# EasyEDA Pro project NRMgmtCRB_v2_final.epro, schematic Schematic1, sheet 1 of 3

## Sheets
1 SoC: Assembly Variant: Basic; Board Name: Board1; Create Date: 2026-01-25; Page Name: P1; Project Name: NRMgmtCRB_v2; Schematic Name: Schematic1; Update Date: 2026-01-25; BladeWidth: 10; Company: 嘉立创EDA; Page Size: A4; RegionStart: 1; ShowBorder: 1; TitleBlock: 0; TitleBlockPosition: 3; Version: V1.0; XRegionCount: 6; YRegionCount: 4
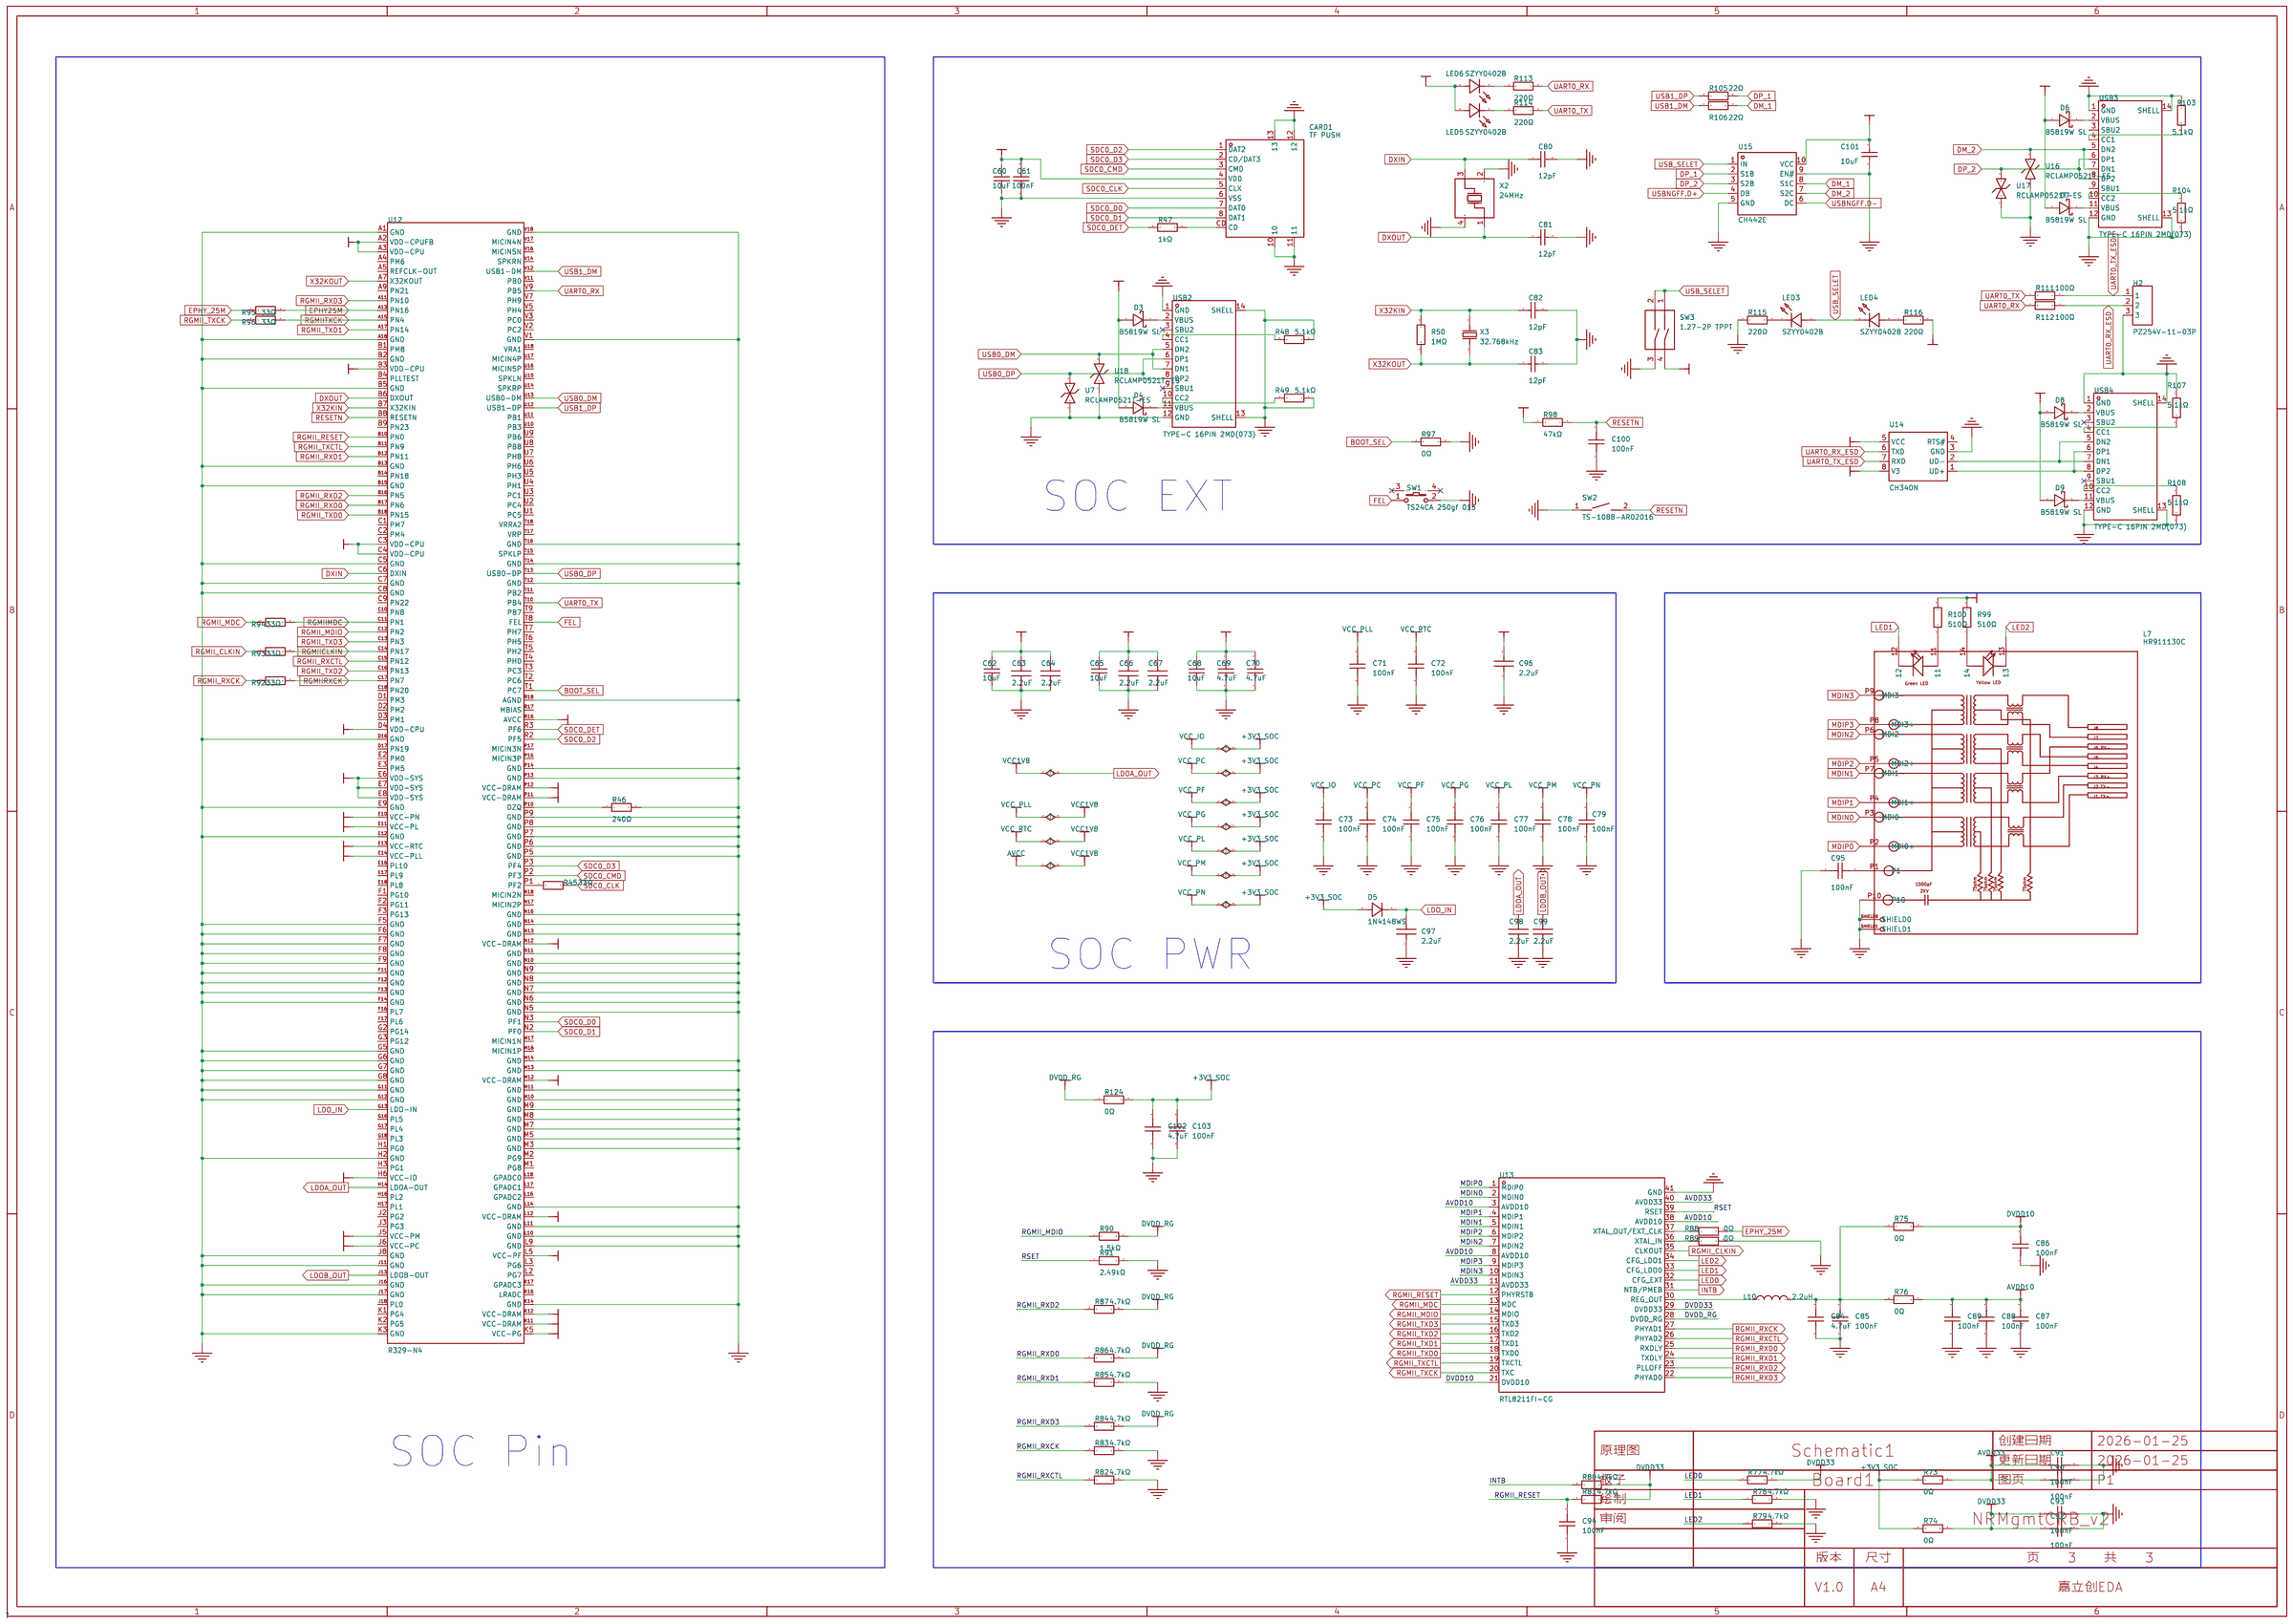
[diagram p0: SoC]

## Parts
C60  10uF  [C0402]
C61  100nF  [C0402]
C62  10uF  [C0402]
C63  2.2uF  [C0402]
C64  2.2uF  [C0402]
C65  10uF  [C0402]
C66  2.2uF  [C0402]
C67  2.2uF  [C0402]
C68  10uF  [C0402]
C69  4.7uF  [C0402]
C70  4.7uF  [C0402]
C71  100nF  [C0402]
C72  100nF  [C0402]
C73  100nF  [C0402]
C74  100nF  [C0402]
C75  100nF  [C0402]
C76  100nF  [C0402]
C77  100nF  [C0402]
C78  100nF  [C0402]
C79  100nF  [C0402]
C80  12pF  [C0402]
C81  12pF  [C0402]
C82  12pF  [C0402]
C83  12pF  [C0402]
C84  4.7uF  [C0402]
C85  100nF  [C0402]
C86  100nF  [C0402]
C87  100nF  [C0402]
C88  100nF  [C0402]
C89  100nF  [C0402]
C90  100nF  [C0402]
C91  100nF  [C0402]
C92  100nF  [C0402]
C93  100nF  [C0402]
C94  100nF  [C0402]
C95  100nF  [C0603]
C96  2.2uF  [C0402]
C97  2.2uF  [C0402]
C98  2.2uF  [C0402]
C99  2.2uF  [C0402]
C100  100nF  [C0402]
C101  10uF  [C0402]
C102  4.7uF  [C0402]
C103  100nF  [C0402]
CARD1  TF PUSH  [TF-SMD_TF-PUSH]
D3  B5819W SL  [SOD-123_L2.7-W1.6-LS3.7-RD-1]
D4  B5819W SL  [SOD-123_L2.7-W1.6-LS3.7-RD-1]
D5  1N4148WS  [SOD-323_L1.7-W1.3-LS2.5-FD]
D6  B5819W SL  [SOD-123_L2.7-W1.6-LS3.7-RD-1]
D7  B5819W SL  [SOD-123_L2.7-W1.6-LS3.7-RD-1]
D8  B5819W SL  [SOD-123_L2.7-W1.6-LS3.7-RD-1]
D9  B5819W SL  [SOD-123_L2.7-W1.6-LS3.7-RD-1]
H2  PZ254V-11-03P  [HDR-TH_3P-P2.54-V-M_PZ254V-11-03P]
L7  HR911130C  [RJ45-TH_HR911130C]
L10  2.2uH  [IND-SMD_L2.0-W1.6-B]
LED3  SZYY0402B  [LED0402-RD_BLUE]
LED4  SZYY0402B  [LED0402-RD_BLUE]
LED5  SZYY0402B  [LED0402-RD_BLUE]
LED6  SZYY0402B  [LED0402-RD_BLUE]
R45  33Ω  [R0402]
R46  240Ω  [R0402]
R47  1kΩ  [R0402]
R48  5.1kΩ  [R0402]
R49  5.1kΩ  [R0402]
R50  1MΩ  [R0402]
R73  0Ω  [R0402]
R74  0Ω  [R0402]
R75  0Ω  [R0402]
R76  0Ω  [R0402]
R77  4.7kΩ  [R0402]
R78  4.7kΩ  [R0402]
R79  4.7kΩ  [R0402]
R80  4.7kΩ  [R0402]
R81  4.7kΩ  [R0402]
R82  4.7kΩ  [R0402]
R83  4.7kΩ  [R0402]
R84  4.7kΩ  [R0402]
R85  4.7kΩ  [R0402]
R86  4.7kΩ  [R0402]
R87  4.7kΩ  [R0402]
R88  0Ω  [R0402]
R89  0Ω  [R0402]
R90  1.5kΩ  [R0402]
R91  2.49kΩ  [R0402]
R92  33Ω  [R0402]
R93  33Ω  [R0402]
R94  33Ω  [R0402]
R95  33Ω  [R0402]
R96  33Ω  [R0402]
R97  0Ω  [R0402]
R98  47kΩ  [R0402]
R99  510Ω  [R0603]
R100  510Ω  [R0603]
R103  5.1kΩ  [R0402]
R104  5.1kΩ  [R0402]
R105  22Ω  [R0402]
R106  22Ω  [R0402]
R107  5.1kΩ  [R0402]
R108  5.1kΩ  [R0402]
R111  100Ω  [R0402]
R112  100Ω  [R0402]
R113  220Ω  [R0402]
R114  220Ω  [R0402]
R115  220Ω  [R0402]
R116  220Ω  [R0402]
R124  0Ω  [R0402]
SW1  TS24CA 250gf 013  [SW-SMD_L4.7-W3.5-P3.35-EH]
SW2  TS-1088-AR02016  [SW-SMD_L3.9-W3.0-P4.45]
SW3  1.27-2P TPPT  [SW-SMD_2P-L5.4-W4.1-P1.27-LS8.4]
U7  RCLAMP0521T-ES  [DFN1006-2L-BI]
U12  R329-N4  [BGA-228_L14.5-W12.0-P0.65-TL_R329-N4]
U13  RTL8211FI-CG  [QFN-40_L5.0-W5.0-P0.40-BL-EP3.7]
U14  CH340N  [SOP-8_L4.9-W3.9-P1.27-LS6.0-BL]
U15  CH442E  [MSOP-10_L3.0-W3.0-P0.50-LS5.0-BL]
U16  RCLAMP0521T-ES  [DFN1006-2L-BI]
U17  RCLAMP0521T-ES  [DFN1006-2L-BI]
U18  RCLAMP0521T-ES  [DFN1006-2L-BI]
USB2  TYPE-C 16PIN 2MD(073)  [USB-C-SMD_TYPE-C-6PIN-2MD-073]
USB3  TYPE-C 16PIN 2MD(073)  [USB-C-SMD_TYPE-C-6PIN-2MD-073]
USB4  TYPE-C 16PIN 2MD(073)  [USB-C-SMD_TYPE-C-6PIN-2MD-073]
X2  24MHz  [CRYSTAL-SMD_4P-L3.2-W2.5-BL]
X3  32.768kHz  [FC-135R_L3.2-W1.5]

## Library data of the parts
C60 C62 C65 C68 C101 = CL05A106MQ5NUNC: 容值:10uF;精度:±20%;额定电压:6.3V;温度系数:X5R;; LCSC Part Name: 10uF ±20% 6.3V; Supplier Part: C15525; Manufacturer: SAMSUNG(三星); Supplier Footprint: 0402; JLCPCB Part Class: Basic Part; Datasheet: https://item.szlcsc.com/datasheet/CL05A106MQ5NUNC/16204.html; Supplier: LCSC; Tolerance: ±20%; Voltage Rating: 6.3V; Temperature Coefficient: X5R
C61 C71 C72 C100 = CL05B104KO5NNNC: 容值:100nF;精度:±10%;额定电压:16V;温度系数:X7R;; LCSC Part Name: 100nF ±10% 16V; Supplier Part: C1525; Manufacturer: SAMSUNG(三星); Supplier Footprint: 0402; JLCPCB Part Class: Basic Part; Datasheet: https://item.szlcsc.com/datasheet/CL05B104KO5NNNC/1877.html; Supplier: LCSC; Tolerance: ±10%; Voltage Rating: 16V; Temperature Coefficient: X7R
C63 C64 C66 C67 C96-C99 = CL05A225MQ5NSNC: 容值:2.2uF;精度:±20%;额定电压:6.3V;温度系数:X5R;; LCSC Part Name: 2.2uF ±20% 6.3V; Supplier Part: C12530; Manufacturer: SAMSUNG(三星); Supplier Footprint: 0402; JLCPCB Part Class: Basic Part; Datasheet: https://item.szlcsc.com/datasheet/CL05A225MQ5NSNC/13164.html; Supplier: LCSC; Tolerance: ±20%; Voltage Rating: 6.3V; Temperature Coefficient: X5R
C69 C70 = CL05A475MP5NRNC: 容值:4.7uF;精度:±20%;额定电压:10V;温度系数:X5R;; LCSC Part Name: 4.7uF ±20% 10V; Supplier Part: C23733; Manufacturer: SAMSUNG(三星); Supplier Footprint: 0402; JLCPCB Part Class: Basic Part; Datasheet: https://item.szlcsc.com/datasheet/CL05A475MP5NRNC/24469.html; Supplier: LCSC; Tolerance: ±20%; Voltage Rating: 10V; Temperature Coefficient: X5R
C73-C79 C85-C94 C103 = CL05B104KO5NNNC: 容值:100nF;精度:±10%;额定电压:16V;温度系数:X7R;; LCSC Part Name: 100nF ±10% 16V; Supplier Part: C1525; Manufacturer: SAMSUNG(三星); Supplier Footprint: 0402; JLCPCB Part Class: Basic Part; Datasheet: https://item.szlcsc.com/datasheet/CL05B104KO5NNNC/1877.html; Supplier: LCSC; Tolerance: ±10%; Voltage Rating: 16V; Temperature Coefficient: X7R; Check: true; Voltage Rated: 16V
C80-C83 = 0402CG120J500NT: 容值:12pF;精度:±5%;额定电压:50V;温度系数:C0G;; LCSC Part Name: 12pF ±5% 50V; Supplier Part: C1547; Manufacturer: FH(风华); Supplier Footprint: 0402; JLCPCB Part Class: Basic Part; Datasheet: https://item.szlcsc.com/datasheet/0402CG120J500NT/1899.html; Supplier: LCSC; Tolerance: ±5%; Voltage Rating: 50V; Temperature Coefficient: C0G
C84 C102 = CL05A475MP5NRNC: 容值:4.7uF;精度:±20%;额定电压:10V;温度系数:X5R;; LCSC Part Name: 4.7uF ±20% 10V; Supplier Part: C23733; Manufacturer: SAMSUNG(三星); Supplier Footprint: 0402; JLCPCB Part Class: Basic Part; Datasheet: https://item.szlcsc.com/datasheet/CL05A475MP5NRNC/24469.html; Supplier: LCSC; Tolerance: ±20%; Voltage Rating: 10V; Temperature Coefficient: X5R; Check: true; Voltage Rated: 10V
C95 = CC0603KRX7R9BB104_1: 容值:100nF;精度:±10%;额定电压:50V;温度系数:X7R;; LCSC Part Name: 100nF ±10% 50V; Supplier Part: C14663; Manufacturer: YAGEO(国巨); Manufacturer Part: CC0603KRX7R9BB104; Supplier Footprint: 0603; JLCPCB Part Class: 基础库; Datasheet: https://item.szlcsc.com/datasheet/CC0603KRX7R9BB104/15331.html; Supplier: LCSC; Tolerance: ±10%; Voltage Rating: 50V; Temperature Coefficient: X7R
CARD1 = TF PUSH: 卡连接方式:自弹式;卡类型:MicroSD卡(TF卡);连接器类型:卡座;本体最大高度:2mm;工作温度:-25℃~+90℃;; LCSC Part Name: 9P，自弹式TF卡座; Supplier Part: C393941; Manufacturer: SHOU HAN(首韩); Supplier Footprint: SMD; JLCPCB Part Class: Extended Part; Datasheet: https://item.szlcsc.com/datasheet/TF%2520PUSH/372553.html; Supplier: LCSC; Card Connection Mode: 自弹式; Card Type: MicroSD卡(TF卡); Connector Type: 卡座; Additional Card Detection Pins: 无; Height Above Board: 2mm; Operating Temperature: -25℃~+90℃
D3 D4 D6-D9 = B5819W SL: 正向压降(Vf):600mV@1A;直流反向耐压(Vr):40V;整流电流:1A;; LCSC Part Name: 电压:40V 电流:1A; Supplier Part: C8598; Manufacturer: CJ(江苏长电/长晶); Supplier Footprint: SOD-123; JLCPCB Part Class: Basic Part; Datasheet: https://item.szlcsc.com/datasheet/B5819W%2520SL/9093.html; Supplier: LCSC; Voltage - Forward(Vf@If): 600mV@1A; Voltage - DC Reverse(Vr): 40V; Current - Rectified: 1A; Non-Repetitive Peak Forward Surge Current: 9A
D5 = 1N4148WS_C7420319: 二极管配置:独立式;正向压降(Vf):1.25V@150mA;直流反向耐压(Vr):100V;整流电流:150mA;反向恢复时间(Trr):4ns;; Supplier Part: C7420319; Manufacturer: R+O(宏嘉诚); Supplier Footprint: SOD-323; JLCPCB Part Class: Extended Part; Datasheet: https://item.szlcsc.com/datasheet/1N4148WS/8397141.html; Supplier: LCSC; Diode Configuration: 独立式; Voltage - Forward(Vf@If): 1.25V@150mA; Voltage - DC Reverse(Vr): 100V; Current - Rectified: 150mA; Pd - Power Dissipation: 200mW; Reverse Leakage Current (Ir): 1uA@75V; Reverse Recovery Time (trr): 4ns; Operating Junction Temperature Range: -55℃~+150℃; Non-Repetitive Peak Forward Surge Current: 2A
H2 = PZ254V-11-03P: 插针结构:1x3P;间距:2.54mm;行距:-;圆针/方针:方针;安装方式:直插;排数:单排;总PIN位数:3P;额定电流:3A;额定电压:250V;配合针长度:6mm;塑高:2.5mm;端接针长度:3mm;工作温度:-40℃~+105℃;颜色:黑色;; LCSC Part Name: 1x3P 间距:2.54mm 方针 直插; Supplier Part: C2937625; Manufacturer: XFCN(兴飞); Supplier Footprint: 插件,P=2.54mm; JLCPCB Part Class: Extended Part; Datasheet: https://item.szlcsc.com/datasheet/PZ254V-11-03P/3293280.html; Supplier: LCSC; Pin Structure: 1x3P; Pitch: 2.54mm; Circluar Pins/Square Pins: 方针; Mounting Type: 直插; Number of Rows: 单排; Number of Pins: 3P; Current Rating: 3A; Voltage Rating (Max): 250V; Length of Mating Pin: 6mm; Insulation Height: 2.5mm; Length of End Connection Pin: 3mm; Operating Temperature: -40℃~+105℃; Color: 黑色
L7 = HR911130C: 连接器类型:RJ45插座;安装方式:弯插;端口数量:1;LED:带LED;屏蔽:有屏蔽;等级:-;触头材质:磷青铜;触头镀层:金;工作温度:0℃~+70℃;; LCSC Part Name: 弯插 带LED; Supplier Part: C50933; Manufacturer: HANRUN(汉仁); Supplier Footprint: 弯插; JLCPCB Part Class: Extended Part; Datasheet: https://item.szlcsc.com/datasheet/HR911130C/51945.html; Supplier: LCSC; Connector Type: RJ45插座; Mounting Type: 弯插; Number of Ports: 1; LED: 带LED; Shielding: 有屏蔽; PoE: 不带PoE; Contact Material: 磷青铜; Contact Plating: 金; Operating Temperature: 0℃~+70℃
L10 = FTC201610S2R2MBCA: 电感值:2.2uH;精度:±20%;额定电流:2.5A;饱和电流(Isat):3A;类型:一体成型电感;; LCSC Part Name: 2.2uH ±20% 3A; Supplier Part: C5832344; Manufacturer: cjiang(长江微电); Supplier Footprint: SMD,1.6x2mm; JLCPCB Part Class: 扩展库; Datasheet: https://atta.szlcsc.com/upload/public/pdf/source/20230602/8FFEDA9C0247A92A0D4B67554BFE4091.pdf; Supplier: LCSC; Tolerance: ±20%; Rated Current: 2.5A; Saturation Current (Isat): 3A; DC Resistance (DCR): 120mΩ; Type: 一体成型电感
LED3-LED6 = SZYY0402B: 发光颜色:蓝色;功率:-;正向电流:5mA;主波长:466nm~469nm;色温:-;发光角度:120°;载带方式:-;工作温度:-40℃~+85℃;; LCSC Part Name: 蓝灯; Supplier Part: C434447; Manufacturer: yongyu(永裕光电); Supplier Footprint: 0402; JLCPCB Part Class: Extended Part; Datasheet: https://atta.szlcsc.com/upload/public/pdf/source/20210222/C434447_30232BB6183B52026028ECA50B9DAB35.pdf; Supplier: LCSC; Emitted Color: 蓝色; Forward Current: 5mA; Dominant Wavelength: 466nm~469nm; Viewing Angle: 120°; Operating Temperature: -40℃~+85℃
R45 R92-R96 = 0402WGF330JTCE: 电阻类型:厚膜电阻;阻值:33Ω;精度:±1%;功率:62.5mW;工作电压:50V;温度系数:±100ppm/℃;; LCSC Part Name: 33Ω ±1% 62.5mW 厚膜电阻; Supplier Part: C25105; Manufacturer: UNI-ROYAL(厚声); Supplier Footprint: 0402; JLCPCB Part Class: Basic Part; Datasheet: https://item.szlcsc.com/datasheet/0402WGF330JTCE/25848.html; Supplier: LCSC; Type: 厚膜电阻; Tolerance: ±1%; Power(Watts): 62.5mW; Voltage-Supply(Max): 50V; Temperature Coefficient: ±100ppm/℃; Operating Temperature: -55℃~+155℃
R46 = 0402WGF2400TCE: 电阻类型:厚膜电阻;阻值:240Ω;精度:±1%;功率:62.5mW;最大工作电压:50V;温度系数:±100ppm/℃;; LCSC Part Name: 240Ω ±1% 62.5mW 厚膜电阻; Supplier Part: C25094; Manufacturer: UNI-ROYAL(厚声); Supplier Footprint: 0402; JLCPCB Part Class: Extended Part; Datasheet: https://atta.szlcsc.com/upload/public/pdf/source/20200306/C422600_1E6D84923E4A46A82E41ADD87F860B5C.pdf; Supplier: LCSC; Type: 厚膜电阻; Tolerance: ±1%; Power(Watts): 62.5mW; Overload Voltage (Max): 50V; Temperature Coefficient: ±100ppm/℃; Operating Temperature Range: -55℃~+155℃
R47 = 0402WGF1001TCE: 电阻类型:厚膜电阻;阻值:1kΩ;精度:±1%;功率:62.5mW;工作电压:50V;温度系数:±100ppm/℃;; LCSC Part Name: 1kΩ ±1% 62.5mW 厚膜电阻; Supplier Part: C11702; Manufacturer: UNI-ROYAL(厚声); Supplier Footprint: 0402; JLCPCB Part Class: Basic Part; Datasheet: https://item.szlcsc.com/datasheet/0402WGF1001TCE/12256.html; Supplier: LCSC; Type: 厚膜电阻; Tolerance: ±1%; Power(Watts): 62.5mW; Voltage-Supply(Max): 50V; Temperature Coefficient: ±100ppm/℃; Operating Temperature: -55℃~+155℃
R48 R49 R103 R104 R107 R108 = 0402WGF5101TCE: 电阻类型:厚膜电阻;阻值:5.1kΩ;精度:±1%;功率:62.5mW;工作电压:50V;温度系数:±100ppm/℃;; LCSC Part Name: 5.1kΩ ±1% 62.5mW 厚膜电阻; Supplier Part: C25905; Manufacturer: UNI-ROYAL(厚声); Supplier Footprint: 0402; JLCPCB Part Class: Basic Part; Datasheet: https://item.szlcsc.com/datasheet/0402WGF5101TCE/26648.html; Supplier: LCSC; Type: 厚膜电阻; Tolerance: ±1%; Power(Watts): 62.5mW; Voltage-Supply(Max): 50V; Temperature Coefficient: ±100ppm/℃; Operating Temperature: -55℃~+155℃
R50 = 0402WGF1004TCE: 电阻类型:厚膜电阻;阻值:1MΩ;精度:±1%;功率:62.5mW;工作电压:50V;温度系数:±100ppm/℃;; LCSC Part Name: 1MΩ ±1% 62.5mW 厚膜电阻; Supplier Part: C26083; Manufacturer: UNI-ROYAL(厚声); Supplier Footprint: 0402; JLCPCB Part Class: Basic Part; Datasheet: https://item.szlcsc.com/datasheet/0402WGF1004TCE/26826.html; Supplier: LCSC; Type: 厚膜电阻; Tolerance: ±1%; Power(Watts): 62.5mW; Voltage-Supply(Max): 50V; Temperature Coefficient: ±100ppm/℃; Operating Temperature: -55℃~+155℃
R73-R76 R88 R89 R97 R124 = 0402WGF0000TCE: 电阻类型:厚膜电阻;阻值:0Ω;精度:±1%;功率:62.5mW;工作电压:50V;温度系数:±800ppm/℃;; LCSC Part Name: 0Ω ±1% 62.5mW 厚膜电阻; Supplier Part: C17168; Manufacturer: UNI-ROYAL(厚声); Supplier Footprint: 0402; JLCPCB Part Class: Basic Part; Datasheet: https://item.szlcsc.com/datasheet/0402WGF0000TCE/17853.html; Supplier: LCSC; Type: 厚膜电阻; Tolerance: ±1%; Power(Watts): 62.5mW; Voltage-Supply(Max): 50V; Temperature Coefficient: ±800ppm/℃; Operating Temperature: -55℃~+155℃
R77-R87 = 0402WGF4701TCE: 电阻类型:厚膜电阻;阻值:4.7kΩ;精度:±1%;功率:62.5mW;最大工作电压:50V;温度系数:±100ppm/℃;; LCSC Part Name: 4.7kΩ ±1% 62.5mW 厚膜电阻; Supplier Part: C25900; Manufacturer: UNI-ROYAL(厚声); Supplier Footprint: 0402; JLCPCB Part Class: Basic Part; Datasheet: https://atta.szlcsc.com/upload/public/pdf/source/20200306/C422600_1E6D84923E4A46A82E41ADD87F860B5C.pdf; Supplier: LCSC; Type: 厚膜电阻; Tolerance: ±1%; Power(Watts): 62.5mW; Overload Voltage (Max): 50V; Temperature Coefficient: ±100ppm/℃; Operating Temperature Range: -55℃~+155℃
R90 = 0402WGF1501TCE: 电阻类型:厚膜电阻;阻值:1.5kΩ;精度:±1%;功率:62.5mW;最大工作电压:50V;温度系数:±100ppm/℃;; LCSC Part Name: 1.5kΩ ±1% 62.5mW 厚膜电阻; Supplier Part: C25867; Manufacturer: UNI-ROYAL(厚声); Supplier Footprint: 0402; JLCPCB Part Class: Basic Part; Datasheet: https://atta.szlcsc.com/upload/public/pdf/source/20200306/C422600_1E6D84923E4A46A82E41ADD87F860B5C.pdf; Supplier: LCSC; Type: 厚膜电阻; Tolerance: ±1%; Power(Watts): 62.5mW; Overload Voltage (Max): 50V; Temperature Coefficient: ±100ppm/℃; Operating Temperature Range: -55℃~+155℃
R91 = 0402WGF2491TCE: 电阻类型:厚膜电阻;阻值:2.49kΩ;精度:±1%;功率:62.5mW;最大工作电压:50V;温度系数:±100ppm/℃;; LCSC Part Name: 2.49kΩ ±1% 62.5mW 厚膜电阻; Supplier Part: C25884; Manufacturer: UNI-ROYAL(厚声); Supplier Footprint: 0402; JLCPCB Part Class: Extended Part; Datasheet: https://atta.szlcsc.com/upload/public/pdf/source/20200306/C422600_1E6D84923E4A46A82E41ADD87F860B5C.pdf; Supplier: LCSC; Type: 厚膜电阻; Tolerance: ±1%; Power(Watts): 62.5mW; Overload Voltage (Max): 50V; Temperature Coefficient: ±100ppm/℃; Operating Temperature Range: -55℃~+155℃
R98 = 0402WGF4702TCE: 电阻类型:厚膜电阻;阻值:47kΩ;精度:±1%;功率:62.5mW;工作电压:50V;温度系数:±100ppm/℃;; LCSC Part Name: 47kΩ ±1% 62.5mW 厚膜电阻; Supplier Part: C25792; Manufacturer: UNI-ROYAL(厚声); Supplier Footprint: 0402; JLCPCB Part Class: Basic Part; Datasheet: https://item.szlcsc.com/datasheet/0402WGF4702TCE/26535.html; Supplier: LCSC; Type: 厚膜电阻; Tolerance: ±1%; Power(Watts): 62.5mW; Voltage-Supply(Max): 50V; Temperature Coefficient: ±100ppm/℃; Operating Temperature: -55℃~+155℃
R99 R100 = 0603WAF5100T5E: 电阻类型:厚膜电阻;阻值:510Ω;精度:±1%;功率:100mW;工作电压:75V;温度系数:±100ppm/℃;; LCSC Part Name: 510Ω ±1% 100mW 厚膜电阻; Supplier Part: C23193; Manufacturer: UNI-ROYAL(厚声); Supplier Footprint: 0603; JLCPCB Part Class: Basic Part; Datasheet: https://item.szlcsc.com/datasheet/0603WAF5100T5E/23920.html; Supplier: LCSC; Type: 厚膜电阻; Tolerance: ±1%; Power(Watts): 100mW; Voltage-Supply(Max): 75V; Temperature Coefficient: ±100ppm/℃; Operating Temperature: -55℃~+155℃
R105 R106 = 0402WGF220JTCE: 电阻类型:厚膜电阻;阻值:22Ω;精度:±1%;功率:62.5mW;最大工作电压:50V;温度系数:±100ppm/℃;; LCSC Part Name: 22Ω ±1% 62.5mW 厚膜电阻; Supplier Part: C25092; Manufacturer: UNI-ROYAL(厚声); Supplier Footprint: 0402; JLCPCB Part Class: Basic Part; Datasheet: https://atta.szlcsc.com/upload/public/pdf/source/20200306/C422600_1E6D84923E4A46A82E41ADD87F860B5C.pdf; Supplier: LCSC; Type: 厚膜电阻; Tolerance: ±1%; Power(Watts): 62.5mW; Overload Voltage (Max): 50V; Temperature Coefficient: ±100ppm/℃; Operating Temperature Range: -55℃~+155℃
R111 R112 = 0402WGF1000TCE: 电阻类型:厚膜电阻;阻值:100Ω;精度:±1%;功率:62.5mW;最大工作电压:50V;温度系数:±200ppm/℃;; LCSC Part Name: 100Ω ±1% 62.5mW 厚膜电阻; Supplier Part: C25076; Manufacturer: UNI-ROYAL(厚声); Supplier Footprint: 0402; JLCPCB Part Class: Basic Part; Datasheet: https://atta.szlcsc.com/upload/public/pdf/source/20200306/C422600_1E6D84923E4A46A82E41ADD87F860B5C.pdf; Supplier: LCSC; Type: 厚膜电阻; Tolerance: ±1%; Power(Watts): 62.5mW; Overload Voltage (Max): 50V; Temperature Coefficient: ±200ppm/℃; Operating Temperature Range: -55℃~+155℃
R113-R116 = 0402WGF2200TCE: 电阻类型:厚膜电阻;阻值:220Ω;精度:±1%;功率:62.5mW;工作电压:50V;温度系数:±100ppm/℃;; LCSC Part Name: 220Ω ±1% 62.5mW 厚膜电阻; Supplier Part: C25091; Manufacturer: UNI-ROYAL(厚声); Supplier Footprint: 0402; JLCPCB Part Class: Basic Part; Datasheet: https://item.szlcsc.com/datasheet/0402WGF2200TCE/25834.html; Supplier: LCSC; Type: 厚膜电阻; Tolerance: ±1%; Power(Watts): 62.5mW; Voltage-Supply(Max): 50V; Temperature Coefficient: ±100ppm/℃; Operating Temperature: -55℃~+155℃
SW1 = TS24CA 250gf 013: 电路结构:单刀单掷;按钮形状:矩形按钮;作用力:2.5N;安装方式:卧贴;开关长度:-;开关宽度:-;开关高度:-;带支架:不带支架;触点电流:50mA;额定电压:12V;带灯:无;工作寿命:3万次;; LCSC Part Name: 2*4*3.5mm半包小贝贝TS-018小侧按键m165蓝牙耳机开关 250gf; Supplier Part: C5373430; Manufacturer: SHOU HAN(首韩); Supplier Footprint: SMD; JLCPCB Part Class: Extended Part; Datasheet: https://item.szlcsc.com/datasheet/TS24CA%2520250gf%2520013/6227347.html; Supplier: LCSC; Circuit: 单刀单掷; Actuator Style: 矩形按钮; Operating Force: 2.5N; Mounting Type: 卧贴; with Bracket: 不带支架; Contact Current: 50mA; Voltage Rating: 12V; Actuator/Cap Color: 黑色; With Lamp: 无; Life: 3万次; Operating Temperature: -40℃~+85℃
SW2 = TS-1088-AR02016: 电路结构:单刀单掷;按钮形状:圆形按钮;作用力:1.6N;安装方式:立贴;开关长度:4mm;开关宽度:3mm;开关高度:2mm;带支架:不带支架;触点电流:50mA;额定电压:12V;工作寿命:10万次;; LCSC Part Name: 4*3*2mm 立贴 轻触开关; Supplier Part: C720477; Manufacturer: XUNPU(讯普); Supplier Footprint: SMD,4x3mm; JLCPCB Part Class: Basic Part; Datasheet: https://item.szlcsc.com/datasheet/TS-1088-AR02016/763484.html; Supplier: LCSC; Circuit: 单刀单掷; Actuator Style: 圆形按钮; Operating Force: 1.6N; Mounting Type: 立贴; Length: 4mm; Width: 3mm; Switch Height: 2mm; with Bracket: 不带支架; Contact Current: 50mA; Voltage Rating: 12V; Actuator/Cap Color: 黑色; Termination Style: SMD接片; Life: 10万次; Operating Temperature: -30℃~+80℃
SW3 = 1.27-2P TPPT: 类型:平拨,凹槽式;电路结构:单刀单掷;开关位数:2位;额定电流:25mA;额定电压:24V;工作寿命:2千次;颜色:黑色;; LCSC Part Name: 1.27-2P贴片平推有LOGO贴膜编带; Supplier Part: C7421516; Manufacturer: SHOU HAN(首韩); Supplier Footprint: SMD,P=1.27mm; JLCPCB Part Class: Extended Part; Datasheet: https://item.szlcsc.com/datasheet/1.27-2P%2520TPPT/8402819.html; Supplier: LCSC; Type: 平拨,凹槽式; Circuit: 单刀单掷; Number of Positions: 2位; Termination Style: 鸥翼型; Lead Pitch: 1.27mm; Current Rating: 25mA; Voltage Rating: 24V; Operating Temperature: -30℃~+85℃; Operating Life: 2千次; Color: 黑色
U7 U16-U18 = RCLAMP0521T-ES: 极性:双向;反向截止电压(Vrwm):5V;最大钳位电压:18V;峰值脉冲电流(Ipp):4A;峰值脉冲功率(Ppp):80W;击穿电压:6V;; LCSC Part Name: 0521/0531，单路双向ESD静电防护器件，20kV，CJ：0.25pF；HDMI/USB/NFC/RF超高速接口通讯防护; Supplier Part: C5180263; Manufacturer: ElecSuper(静芯微); Supplier Footprint: DFN1006-2L; JLCPCB Part Class: Extended Part; Datasheet: https://atta.szlcsc.com/upload/public/pdf/source/20240905/E90AFA5EC59D44930BEC0D45A1143918.pdf; Supplier: LCSC; polarity: 双向; Reverse Stand-Off Voltage (Vrwm): 5V; Maximum Clamping Voltage: 18V; Peak Pulse Current (Ipp): 4A; Peak Pulse Power Dissipation (Ppp): 80W; Breakdown Voltage: 6V; Reverse Leakage Current (Ir): 1uA; Number of Lines: 单路; Type: ESD
U12 = R329-N4: 类型:处理器;接口类型:I2S；USB;采样率:8kHz~48kHz;; LCSC Part Name: 音频应用处理器; Supplier Part: C3039724; Manufacturer: Allwinner(全志); Supplier Footprint: LFBGA-228; JLCPCB Part Class: Extended Part; Datasheet: https://item.szlcsc.com/datasheet/R329-N4/3595475.html; Supplier: LCSC; Type: 处理器; Interface: I2S；USB; Sampling Rate: 8kHz~48kHz; Voltage - Supply: 2.7V~3.6V; Operating Temperature: -25℃~+85℃
U13 = RTL8211FI-CG: 通道数:-;接口类型:RGMII;; LCSC Part Name: 集成10/100/1000M以太网精密收发器; Supplier Part: C717681; Manufacturer: REALTEK(瑞昱); Supplier Footprint: QFN-40-EP(5x5); JLCPCB Part Class: Extended Part; Datasheet: https://item.szlcsc.com/datasheet/RTL8211FI-CG/758544.html; Supplier: LCSC; Interface: RGMII; Voltage - Supply: 1.8V；2.5V；3.3V；1.5V
U14 = CH340N: 应用功能:USB转串口;USB协议版本:USB 2.0;通道数:1;数据速率:2Mbps;; LCSC Part Name: USB2.0芯片CH340; Supplier Part: C2977777; Manufacturer: WCH(南京沁恒); Supplier Footprint: SOP-8; JLCPCB Part Class: Extended Part; Datasheet: https://item.szlcsc.com/datasheet/CH340N/3390257.html; Supplier: LCSC; Applications Function: USB转串口; USB Protocol: USB 2.0; Number of Channels: 1; Voltage - Supply: 3.3V；5V; Data Rate: 2Mbps; Operating Temperature: -20℃~+70℃
U15 = CH442E: 开关电路:双刀双掷(DPDT);通道数:2;导通电阻(Ron@VCC):16Ω;; LCSC Part Name: 双刀双掷5V低阻模拟开关芯片CH442E; Supplier Part: C150097; Manufacturer: WCH(南京沁恒); Supplier Footprint: MSOP-10; JLCPCB Part Class: Extended Part; Datasheet: https://atta.szlcsc.com/upload/public/pdf/source/20240313/620B938073BDDE47F846FA583072617B.pdf; Supplier: LCSC; Switch Circuit: 双刀双掷(DPDT); Number of Channels: 2; Supply Voltage: 4V~5.5V; Turn-on time: 7ns; On-State Resistance (Max): 16Ω; Turn-off time: 7ns; Operating Temperature: -40℃~+85℃
USB2-USB4 = TYPE-C 16PIN 2MD(073): 连接器类型:Type-C;协议标准:-;公母:母;安装方式:卧贴;触点数量:16P;端口数量:1;额定电流 - 电源:3A;工作温度:-25℃~+85℃;; LCSC Part Name: 16P卧贴母座; Supplier Part: C2765186; Manufacturer: SHOU HAN(首韩); Supplier Footprint: SMD; JLCPCB Part Class: Extended Part; Datasheet: https://item.szlcsc.com/datasheet/TYPE-C%252016PIN%25202MD(073)/2901843.html; Supplier: LCSC; Connector Type: Type-C; Gender: 母; Mounting Type: 卧贴; Number of Contacts: 16P; Number of Ports: 1; Current Rating-Power: 3A; Voltage Rating: 5V; Connect-Disconnect Life: 5千次; Detection color: 黑色; Operating Temperature: -25℃~+85℃
X2 = X322524MOB4SI: 晶振类型:贴片晶振;频率:24MHz;常温频差:±10ppm;负载电容:12pF;频率稳定度:±20ppm;; LCSC Part Name: YSX321SL 24MHZ 4P 3225 12PF ±10PPM -40~85℃ (±20PPM); Supplier Part: C70590; Manufacturer: YXC(扬兴晶振); Supplier Footprint: SMD3225-4P; JLCPCB Part Class: Extended Part; Datasheet: https://item.szlcsc.com/datasheet/X322524MOB4SI/71688.html; Supplier: LCSC; Type: 贴片晶振; Normal temperature Frequency Tolerance: ±10ppm; Load Capacitance: 12pF; Frequency Stability: ±20ppm; Operating Temperature: -40℃~+85℃
X3 = Q13FC13500004_C32346: 晶振类型:贴片晶振;频率:32.768kHz;常温频差:±20ppm;负载电容:12.5pF;; LCSC Part Name: 32.768kHz ±20ppm 12.5pF; Supplier Part: C32346; Manufacturer: EPSON(爱普生); Manufacturer Part: Q13FC13500004; Supplier Footprint: SMD3215-2P; JLCPCB Part Class: Basic Part; Datasheet: https://item.szlcsc.com/datasheet/Q13FC13500004/33310.html; Supplier: LCSC; Type: 贴片晶振; Normal temperature Frequency Tolerance: ±20ppm; Load Capacitance: 12.5pF; Equivalent Series Resistance(ESR): 70kΩ; Operating Temperature: -40℃~+85℃

## Nets
+0V9_SYS: C62.2 C63.2 C64.2 U12.E6(VDD-SYS) U12.E7(VDD-SYS) U12.E8(VDD-SYS) ; also on sheet 2
+1V1_CPU: C65.2 C66.2 C67.2 U12.A2(VDD-CPUFB) U12.A3(VDD-CPU) U12.B3(VDD-CPU) U12.C3(VDD-CPU) U12.C4(VDD-CPU) U12.D4(VDD-CPU) ; also on sheet 2
+1V5_DRAM: C68.2 C69.2 C70.2 U12.K11(VCC-DRAM) U12.K12(VCC-DRAM) U12.L12(VCC-DRAM) U12.M12(VCC-DRAM) U12.N12(VCC-DRAM) U12.P11(VCC-DRAM) U12.P12(VCC-DRAM) ; also on sheet 2
+3V3_SOC: C60.2 C61.2 C73.2 C74.2 C75.2 C76.2 C77.2 C78.2 C79.2 C102.2 C103.2 CARD1.4(VDD) D5.1(A) R73.1 R74.1 R98.1 R99.2 R100.2 R124.2 U12.E10(VCC-PN) U12.E11(VCC-PL) U12.H6(VCC-IO) U12.J5(VCC-PM) U12.J6(VCC-PC) U12.K5(VCC-PG) U12.L5(VCC-PF) U14.5(VCC) U14.8(V3) ; also on sheet 2
+5V: C101.2 D3.2(+) D4.2(+) D6.2(+) D7.2(+) D8.2(+) D9.2(+) LED5.2(A) LED6.2(A) R116.2 SW3.4 U15.10(VCC) ; also on sheet 2
AVCC: C71.2 C72.2 C96.2 C98.2 U12.E13(VCC-RTC) U12.E14(VCC-PLL) U12.H14(LDOA-OUT) U12.R16(AVCC)
AVDD10: C87.2 C88.2 C89.2 R76.2 U13.3(AVDD10) U13.8(AVDD10) U13.38(AVDD10)
AVDD33: C90.1 C91.1 R73.2 U13.11(AVDD33) U13.40(AVDD33)
DVDD10: C86.2 R75.2 U13.21(DVDD10)
DVDD33: C92.1 C93.1 R74.2 R77.2 R80.2 R81.2 U13.29(DVDD33)
DVDD_RG: R84.2 R86.2 R87.2 R90.2 R124.1 U13.28(DVDD_RG)
GND: C60.1 C61.1 C62.1 C63.1 C64.1 C65.1 C66.1 C67.1 C68.1 C69.1 C70.1 C71.1 C72.1 C73.1 C74.1 C75.1 C76.1 C77.1 C78.1 C79.1 C80.2 C81.2 C82.2 C83.2 C84.1 C85.1 C86.1 C87.1 C88.1 C89.1 C90.2 C91.2 C92.2 C93.2 C94.1 C95.1 C96.1 C97.1 C98.1 C99.1 C100.1 C101.1 C102.1 C103.1 CARD1.6(VSS) CARD1.10 CARD1.11 CARD1.12 CARD1.13 H2.3 L7.P10 L7.SHIELD0 L7.SHIELD1 R46.2 R48.1 R49.1 R78.2 R79.2 R82.2 R83.2 R85.2 R89.2 R91.2 R97.2 R103.1 R104.2 R107.1 R108.2 R115.1 SW1.2 SW2.1 SW3.3 U7.1 U12.A1(GND) U12.A18(GND) U12.B2(GND) U12.B5(GND) U12.B13(GND) U12.B15(GND) U12.C5(GND) U12.C7(GND) U12.C8(GND) U12.D16(GND) U12.E9(GND) U12.E12(GND) U12.F5(GND) U12.F6(GND) U12.F7(GND) U12.F8(GND) U12.F9(GND) U12.F11(GND) U12.F12(GND) U12.F13(GND) U12.F14(GND) U12.G5(GND) U12.G6(GND) U12.G7(GND) U12.G8(GND) U12.G11(GND) U12.G12(GND) U12.H2(GND) U12.J8(GND) U12.J11(GND) U12.J16(GND) U12.J17(GND) U12.K3(GND) U12.K14(GND) U12.L9(GND) U12.L10(GND) U12.L11(GND) U12.L14(GND) U12.M3(GND) U12.M5(GND) U12.M7(GND) U12.M8(GND) U12.M9(GND) U12.M10(GND) U12.M11(GND) U12.M13(GND) U12.M14(GND) U12.N5(GND) U12.N6(GND) U12.N7(GND) U12.N8(GND) U12.N9(GND) U12.N10(GND) U12.N11(GND) U12.N13(GND) U12.N14(GND) U12.N16(GND) U12.P5(GND) U12.P6(GND) U12.P7(GND) U12.P8(GND) U12.P9(GND) U12.P13(GND) U12.P14(GND) U12.R18(AGND) U12.T12(GND) U12.T14(GND) U12.T16(GND) U12.V1(GND) U12.V18(GND) U13.41(GND) U14.3(GND) U15.5(GND) U15.9(EN#) U16.1 U17.1 U18.1 USB2.1(GND) USB2.12(GND) USB2.13(SHELL) USB2.14(SHELL) USB3.1(GND) USB3.12(GND) USB3.13(SHELL) USB3.14(SHELL) USB4.1(GND) USB4.12(GND) USB4.13(SHELL) USB4.14(SHELL) X2.2(GND) X2.4(GND) ; also on sheet 2 3
BOOT_SEL: R97.1 U12.T1(PC7)
DM_1: R106.2 U15.8(S1C)
DM_2: U15.7(S2C) U16.2 USB3.5(DN2) USB3.7(DN1)
DP_1: R105.2 U15.2(S1B)
DP_2: U15.3(S2B) U17.2 USB3.6(DP1) USB3.8(DP2)
DXIN: C80.1 U12.C6(DXIN) X2.3(OSC2)
DXOUT: C81.1 U12.B6(DXOUT) X2.1(OSC1)
EPHY25M: R95.2 U12.A13(PN16)
EPHY_25M: R88.2 R95.1
FEL: SW1.1 U12.T8(FEL)
INTB: R80.1 U13.31(NTB/PMEB)
LDO_IN: C97.2 D5.2(K) U12.G13(LDO-IN)
LDOB_OUT: C99.2 U12.J13(LDOB-OUT)
LED0: R77.1 U13.32(CFG_EXT)
LED1: L7.12 R78.1 U13.33(CFG_LDO0)
LED2: L7.13 R79.1 U13.34(CFG_LDO1)
MDIN0: L7.P3(MDI0-) U13.2(MDIN0)
MDIN1: L7.P7(MDI1-) U13.5(MDIN1)
MDIN2: L7.P6(MDI2-) U13.7(MDIN2)
MDIN3: L7.P9(MDI3-) U13.10(MDIN3)
MDIP0: L7.P2(MDI0+) U13.1(MDIP0)
MDIP1: L7.P4(MDI1+) U13.4(MDIP1)
MDIP2: L7.P5(MDI2+) U13.6(MDIP2)
MDIP3: L7.P8(MDI3+) U13.9(MDIP3)
RESETN: C100.2 R98.2 SW2.2 U12.B8(RESETN)
RGMII_CLKIN: R93.1 U13.35(CLKOUT)
RGMII_MDC: R94.1 U13.13(MDC)
RGMII_MDIO: R90.1 U12.C12(PN2) U13.14(MDIO)
RGMII_RESET: C94.2 R81.1 U12.B10(PN0) U13.12(PHYRSTB)
RGMII_RXCK: R83.1 R92.1 U13.27(PHYAD1)
RGMII_RXCTL: R82.1 U12.C15(PN12) U13.26(PHYAD2)
RGMII_RXD0: R86.1 U12.B17(PN6) U13.25(RXDLY)
RGMII_RXD1: R85.1 U12.B12(PN11) U13.24(TXDLY)
RGMII_RXD2: R87.1 U12.B16(PN5) U13.23(PLLOFF)
RGMII_RXD3: R84.1 U12.A11(PN10) U13.22(PHYAD0)
RGMII_TXCK: R96.1 U13.20(TXC)
RGMII_TXCTL: U12.B11(PN9) U13.19(TXCTL)
RGMII_TXD0: U12.B18(PN15) U13.18(TXD0)
RGMII_TXD1: U12.A17(PN14) U13.17(TXD1)
RGMII_TXD2: U12.C16(PN13) U13.16(TXD2)
RGMII_TXD3: U12.C13(PN3) U13.15(TXD3)
RGMIICLKIN: R93.2 U12.C14(PN17)
RGMIIMDC: R94.2 U12.C11(PN1)
RGMIIRXCK: R92.2 U12.C17(PN7)
RGMIITXCK: R96.2 U12.A15(PN4)
RSET: R91.1 U13.39(RSET)
SDC0_CLK: CARD1.5(CLX) R45.2
SDC0_CMD: CARD1.3(CMD) U12.P2(PF3)
SDC0_D0: CARD1.7(DAT0) U12.N3(PF1)
SDC0_D1: CARD1.8(DAT1) U12.N2(PF0)
SDC0_D2: CARD1.1(DAT2) U12.R2(PF5)
SDC0_D3: CARD1.2(CD/DAT3) U12.P3(PF4)
SDC0_DET: R47.1 U12.R3(PF6)
UART0_RX: R112.1 R113.2 U12.V9(PB5)
UART0_RX_ESD: H2.2 R112.2 U14.6(TXD)
UART0_TX: R111.1 R114.2 U12.T10(PB4)
UART0_TX_ESD: H2.1 R111.2 U14.7(RXD)
USB0_DM: U12.U13(USB0-DM) U18.2 USB2.5(DN2) USB2.7(DN1)
USB0_DP: U7.2 U12.T13(USB0-DP) USB2.6(DP1) USB2.8(DP2)
USB1_DM: R106.1 U12.V12(USB1-DM)
USB1_DP: R105.1 U12.U12(USB1-DP)
USB_SELET: LED3.2(A) LED4.1(K) SW3.1 SW3.2 U15.1(IN)
USBNGFF.D+: U15.4(DB) ; also on sheet 3
USBNGFF.D-: U15.6(DC) ; also on sheet 3
X32KIN: C82.1 R50.2 U12.B7(X32KIN) X3.2
X32KOUT: C83.1 R50.1 U12.A7(X32KOUT) X3.1
$3N6: R45.1 U12.P1(PF2)
$3N49: R46.1 U12.P10(DZQ)
$3N69: CARD1.CD R47.2
$3N88: D3.1(-) USB2.2(VBUS)
$3N89: D4.1(-) USB2.11(VBUS)
$3N99: R48.2 USB2.4(CC1)
$3N100: R49.2 USB2.10(CC2)
$3N210: C84.2 C85.2 L10.2 R75.1 R76.1
$3N211: L10.1 U13.30(REG_OUT)
$3N241: R88.1 U13.37(XTAL_OUT/EXT_CLK)
$3N244: R89.1 U13.36(XTAL_IN)
$3N247: C95.2 L7.P1
$3N332: L7.14 R99.1
$3N333: L7.11 R100.1
$3N370: D6.1(-) USB3.2(VBUS)
$3N372: D7.1(-) USB3.11(VBUS)
$3N375: R103.2 USB3.4(CC1)
$3N377: R104.1 USB3.10(CC2)
$3N389: U14.2(UD-) USB4.5(DN2) USB4.7(DN1)
$3N391: U14.1(UD+) USB4.6(DP1) USB4.8(DP2)
$3N393: D8.1(-) USB4.2(VBUS)
$3N395: D9.1(-) USB4.11(VBUS)
$3N396: R107.2 USB4.4(CC1)
$3N397: R108.1 USB4.10(CC2)
$3N406: LED5.1(K) R114.1
$3N407: LED6.1(K) R113.1
$3N424: LED3.1(K) R115.2
$3N425: LED4.2(A) R116.1

Not connected (* = marked no-connect by the designer): SW1 3* 4*; U12 A4(PM6) A5(REFCLK-OUT) A9(PN21) B1(PM8) B4(PLLTEST) B9(PN23) B14(PN18) C1(PM7) C2(PM4) C9(PN22) C10(PN8) C18(PN20) D1(PM3) D2(PM2) D3(PM1) D17(PN19) E2(PM0) E3(PM5) E16(PL10) E17(PL9) E18(PL8) F1(PG10) F2(PG11) F3(PG13) F16(PL7) F17(PL6) G2(PG14) G3(PG12) G16(PL5) G17(PL4) G18(PL3) H1(PG0) H3(PG1) H16(PL2) H17(PL1) J2(PG2) J3(PG3) J18(PL0) K1(PG4) K2(PG5) K16(LRADC) K17(GPADC3) L2(PG7) L3(PG6) L16(GPADC2) L17(GPADC1) L18(GPADC0) M1(PG8) M2(PG9) M16(MICIN1P) M17(MICIN1N) N17(MICIN2P) N18(MICIN2N) P16(MICIN3P) P17(MICIN3N) R17(MBIAS) T2(PC6) T3(PC3) T4(PH0) T5(PH2) T6(PH5) T7(PH7) T9(PB7) T11(PB2) T15(SPKLP) T17(VRP) T18(VRRA2) U1(PC5) U2(PC4) U3(PC1) U4(PH1) U5(PH3) U6(PH6) U7(PH8) U8(PB8) U9(PB6) U10(PB3) U11(PB1) U14(SPKRP) U15(SPKLN) U16(MICIN5P) U17(MICIN4P) U18(VRA1) V2(PC2) V3(PC0) V5(PH4) V7(PH9) V11(PB0) V14(SPKRN) V16(MICIN5N) V17(MICIN4N); U14 4(RTS#); USB2 3(SBU2)* 9(SBU1)*; USB3 3(SBU2) 9(SBU1); USB4 3(SBU2)* 9(SBU1)*

## Notes on the sheets
sheet 1
- SOC EXT
- SOC PWR
- SOC Pin
